# Altium schematic sheet MainSheet.SchDoc: Kapcsolás a schematikok között
size A4; ENG_APP_DATE: --/--/--; DSN_APP_DATE: --/--/--; CHK_APP_DATE: --/--/--; Author: Horváth Patrik; Organization: BME-AUT; DocumentNumber: 1; Revision: A29; SheetNumber: 1; SheetTotal: 4
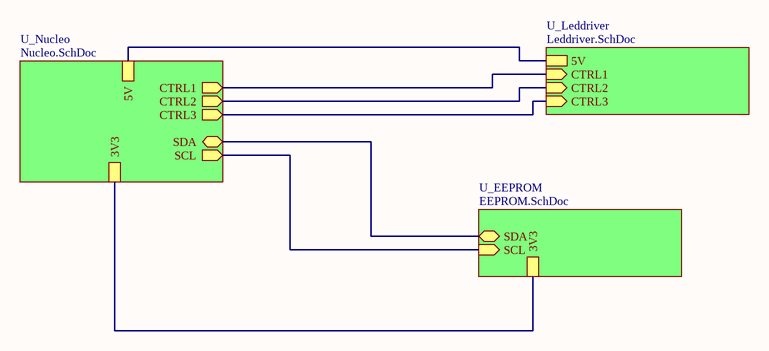
[diagram p0: MainSheet.SchDoc]

## Sub-sheets
U_EEPROM = EEPROM.SchDoc: 3V3, SDA (bidir), SCL (in)
U_Leddriver = Leddriver.SchDoc: 5V, CTRL1 (in), CTRL2 (in), CTRL3 (in)
U_Nucleo = Nucleo.SchDoc: SDA (bidir), SCL (out), 3V3, 5V, CTRL1 (out), CTRL2 (out), CTRL3 (out)

## Nets
(unnamed): sheet U_Leddriver/5V, sheet U_Nucleo/5V
(unnamed): sheet U_Leddriver/CTRL1, sheet U_Nucleo/CTRL1
(unnamed): sheet U_Leddriver/CTRL2, sheet U_Nucleo/CTRL2
(unnamed): sheet U_Leddriver/CTRL3, sheet U_Nucleo/CTRL3
(unnamed): sheet U_Nucleo/SDA, sheet U_EEPROM/SDA
(unnamed): sheet U_Nucleo/SCL, sheet U_EEPROM/SCL
(unnamed): sheet U_Nucleo/3V3, sheet U_EEPROM/3V3

## Notes on the sheet
- Title
- Size:
- Date:
- A4
- Number:
- Time:
- Revision:
- Sheet
- of
- File: